# EasyEDA Pro project ProDocument_Schematic1_2023-08-22.epro

# Schematic Schematic1
Create Date: 2022-09-20; Page Name: P1; Project Name: 智能体重测量系统; Schematic Name: Schematic1; Update Date: 2022-09-21; Company: 嘉立创EDA
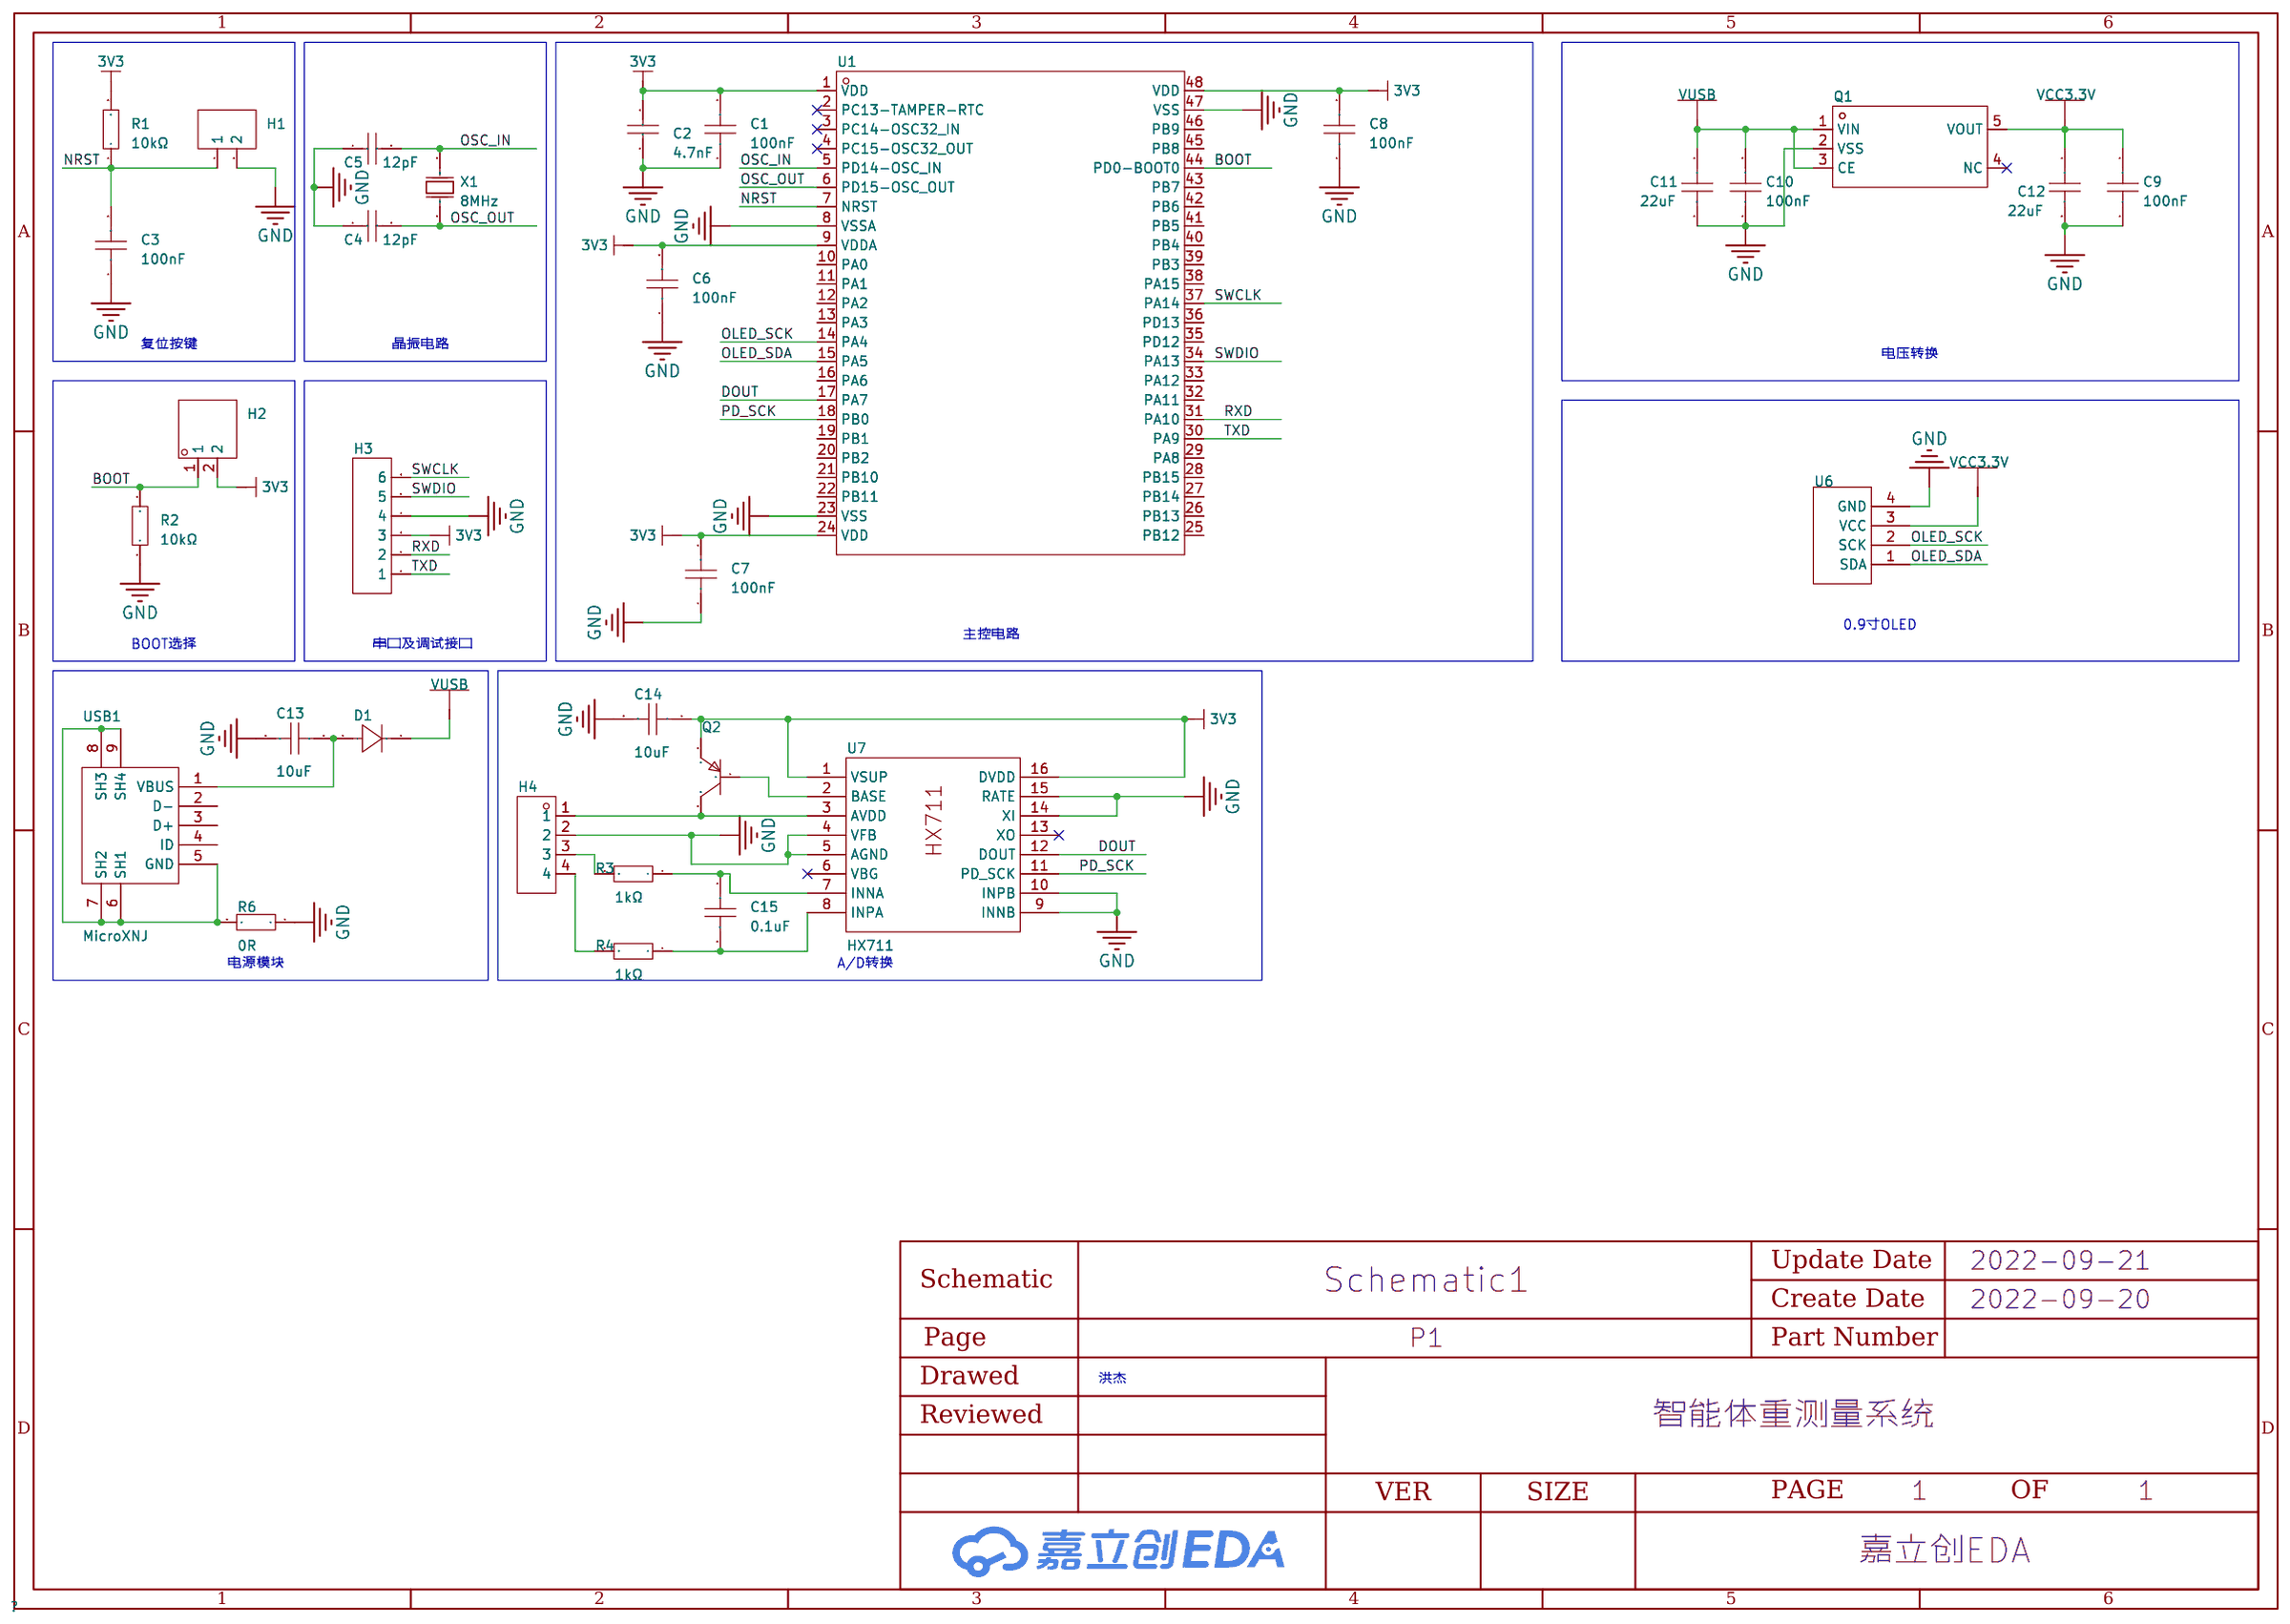
[diagram p0: schematic sheet]

## Parts
C1  100nF  [C0603]
C2  4.7nF  [C0603]
C3  100nF  [C0603]
C4  12pF  [C0603]
C5  12pF  [C0603]
C6  100nF  [C0603]
C7  100nF  [C0603]
C8  100nF  [C0603]
C9  100nF  [C0603]
C10  100nF  [C0603]
C11  22uF  [C0603]
C12  22uF  [C0603]
C13  10uF  [C0603]
C14  10uF  [C0603]
C15  0.1uF  [C0603]
D1  -  [DO-41_BD2.4-L4.7-P8.70-D0.9-RD]
H1  -  [HDR-TH_2P-P2.54-V-F]
H2  -  [HDR-TH_2P-P2.54-V-M-1]
H3  -  [HDR-TH_6P-P2.54-V-M-1]
H4  -  [HDR-TH_4P-P2.54-V-M]
Q1  -  [SOT-25-5_L3.0-W1.8-P0.95-LS3.0-BR]
Q2  -  [TO-236-3_L2.9-W1.3-P1.90-LS2.4-BR]
R1  10kΩ  [R0603]
R2  10kΩ  [R0603]
R3  1kΩ  [R0603]
R4  1kΩ  [R0603]
R6  0R  [R0603]
U1  N32G430C8L7  [LQFP-48_L7.0-W7.0-P0.50-LS9.0-BL]
U6  0.91OLED-IIC-IO4  [0.91-OLED-IIC-12832]
U7  HX711  [SOP-16_L10.0-W3.9-P1.27-LS6.0-BL]
USB1  MicroXNJ  [MICRO-USB-SMD_MICROXNJ]
X1  8MHz  [OSC-SMD_L5.0-W3.2]

## Library data of the parts
C1 C3 C6-C8 C13-C15 = CC0603KRX7R9BB104: 容值:100nF;精度:±10%;额定电压:50V;材质(温度系数):X7R;; LCSC Part Name: 100nF ±10% 50V; Supplier Part: C14663; Manufacturer: YAGEO(国巨); Supplier Footprint: 0603; JLCPCB Part Class: 基础库; Datasheet: https://atta.szlcsc.com/upload/public/pdf/source/20170116/1484561234239.pdf; Supplier: LCSC; Tolerance: ±10%; Voltage Rated: 50V; Temperature Coefficient: X7R
C2 = 1206B472K102NT: 容值:4.7nF;精度:±10%;额定电压:1kV;材质(温度系数):X7R;; LCSC Part Name: 4.7nF ±10% 1kV; Supplier Part: C9192; Manufacturer: FH(风华); Supplier Footprint: 1206; JLCPCB Part Class: 扩展库; Datasheet: https://atta.szlcsc.com/upload/public/pdf/source/20170923/C9192_1506149570157988982.pdf; Supplier: LCSC; Tolerance: ±10%; Voltage Rated: 1kV; Temperature Coefficient: X7R
C4 C5 = CL10C120JB8NNNC: 温度系数:C0G;容值:12pF;精度:±5%;额定电压:50V;; LCSC Part Name: 12pF(120) ±5% 50V; Supplier Part: C38523; Manufacturer: SAMSUNG(三星); Supplier Footprint: 0603; JLCPCB Part Class: 基础库; Datasheet: https://atta.szlcsc.com/upload/public/pdf/source/20160103/1457707725436.pdf; Supplier: LCSC; Temperature Coefficient: C0G; Tolerance: ±5%; Voltage Rated: 50V
C9 C10 = HMK107B7104KA-T: 容值:100nF;精度:±10%;额定电压:100V;温度系数:X7R;; LCSC Part Name: 100nF ±10% 100V; Supplier Part: C385971; Manufacturer: TAIYO YUDEN(太诱); Supplier Footprint: 0603; JLCPCB Part Class: Extended Part; Datasheet: https://atta.szlcsc.com/upload/public/pdf/source/20190425/C385971_F9611C3959A75AB059BC924634A5F45B.pdf; Supplier: LCSC; Tolerance: ±10%; Voltage Rated: 100V; Temperature Coefficient: X7R
C11 C12 = GRM186R60J226ME15D: 容值:22uF;精度:±20%;额定电压:6.3V;温度系数:X5R;; LCSC Part Name: 22uF ±20% 6.3V; Supplier Part: C237460; Manufacturer: muRata(村田); Supplier Footprint: 0603; JLCPCB Part Class: Extended Part; Datasheet: https://atta.szlcsc.com/upload/public/pdf/source/20181211/C237460_A5C1E874024C2D1A3551B41AB30C20A3.pdf; Supplier: LCSC; Tolerance: ±20%; Voltage Rated: 6.3V; Temperature Coefficient: X5R
D1 = 1N4007: 二极管配置:-;直流反向耐压(Vr):1kV;平均整流电流(Io):1A;正向压降(Vf):1.1V@1A;反向电流(Ir):5A@1kV;; Supplier Footprint: DO-41; Supplier Part: C106903; JLCPCB Part Class: Extended Part
H1 = HDR-F_2.54_1x2P: Supplier Part: C49661; Supplier Footprint: 插件
H2 = HDR-M_2.54_1x2P: Supplier Part: C124375; Supplier Footprint: 插件
H3 = HDR-M_2.54_1x6P: Supplier Part: C37208; Supplier Footprint: 插件
H4 = HDR-M_2.54_1x4P: Supplier Part: C492403; Supplier Footprint: 插件
Q1 = XC6220B331MR-G: 输出类型:固定;输出极性:正;输出通道数:1;最大输入电压:6V;输出电压:3.3V;压差:655mV@(1A);输出电流:1A;电源纹波抑制比(PRSS):50dB@(1kHz);; LCSC Part Name: Vin=6V Vout=3.3V 1A 50dB@(1kHz); Supplier Part: C86534; Manufacturer: TOREX(特瑞仕); Supplier Footprint: SOT-25; JLCPCB Part Class: Extended Part; Datasheet: https://atta.szlcsc.com/upload/public/pdf/source/20161119/1479540186106.pdf; Supplier: LCSC; Output Type: 固定; Output Polarity: 正; Number of Outputs: 1; Maximum Input Voltage: 6V; Output Voltage: 3.3V; Dropout Voltage: 655mV@(1A); Output Current: 1A; Power Supply Rejection Ratio (PRSS): 50dB@(1kHz)
Q2 = S8550_PNP: 晶体管类型:PNP;集射极击穿电压(Vceo):25V;集电极电流(Ic):500mA;功率(Pd):300mW;集电极-发射极饱和电压(VCE(sat)@Ic,Ib):600mV@500mA,50mA;直流电流增益(hFE@Ic,Vce):-;特征频率(fT):150MHz;工作温度:+150@(Tj);; Supplier Part: C444725; Supplier Footprint: SOT-23
R1-R4 = 0603WAF1002T5E: 电阻类型:厚膜电阻;阻值:10kΩ;精度:±1%;功率:100mW;温度系数:±100ppm/;最大工作电压:75V;工作温度范围:-55~+155;; LCSC Part Name: 10kΩ ±1% 100mW; Supplier Part: C25804; Manufacturer: UNI-ROYAL(厚声); Supplier Footprint: 0603; JLCPCB Part Class: 基础库; Datasheet: https://atta.szlcsc.com/upload/public/pdf/source/20200306/C422600_1E6D84923E4A46A82E41ADD87F860B5C.pdf; Supplier: LCSC; Type: 厚膜电阻; Tolerance: ±1%; Power(Watts): 100mW; Temperature Coefficient: ±100ppm/; Overload Voltage (Max): 75V; Operating Temperature Range: -55~+155
R6 = Res_0603: Supplier Footprint: 0603; Supplier Part: C713447
U1 = N32G430C8L7: Supplier Part: C3032170; Manufacturer: Nations(国民技术); Supplier Footprint: LQFP48; JLCPCB Part Class: 扩展库; Datasheet: https://atta.szlcsc.com/upload/public/pdf/source/20220608/411F2C1C49F3955F5F0689A973473AF7.pdf; Supplier: LCSC
U6 = 0.91oled-iic-io4: Pin Type: IN
U7 = HX711: A/D 位数:24;采样率（sps）:10,80;输入数:2;输入类型:Differential;; Supplier Part: C43656; Manufacturer: AVIA(海芯科技); Supplier Footprint: SOP-16_150mil; JLCPCB Part Class: 扩展库; Datasheet: https://atta.szlcsc.com/upload/public/pdf/source/20201105/C43656_14FD91CAE53E7DB415D03EABCB162D83.pdf; Supplier: LCSC; Number of Bits: 24; Sampling Rate (Per Second): 10,80; Number of Inputs: 2; Input Type: Differential; Voltage - Supply: 2.6V~5.5V
USB1 = MicroXNJ: 连接器类型:Micro-B;标准:USB 2.0;公母:母座;触点数量:5;端口数量:1;安装方式:卧贴;额定电流 - 电源:1A;工作温度范围:-20~+85;; LCSC Part Name: MICRO USB 母座 小牛角有柱 卷边 编带; Supplier Part: C404969; Manufacturer: SHOU HAN(首韩); Supplier Footprint: SMD; JLCPCB Part Class: 扩展库; Datasheet: https://atta.szlcsc.com/upload/public/pdf/source/20190722/C404969_F527F22D40F2F6F2B0B236E459D2C165.pdf; Supplier: LCSC; Connector Type: Micro-B; Standard: USB 2.0; Gender: 母座; Number of Contacts: 5; Number of Ports: 1; Mounting Style: 卧贴; Current Rating - Power (Max): 1A; Operating Temperature Range: -20~+85
X1 = TAXM8M2QLFCDT1T: 晶振类型:SMD 谐振器;频率:8MHz;频率公差:±30ppm;频率稳定度:±20ppm;负载电容:20pF;等效串联电阻(ESR):80Ω;工作温度:-40~85;; LCSC Part Name: 8MHz ±30ppm 20pF; Supplier Part: C122522; Manufacturer: TAE(雅晶鑫); Supplier Footprint: SMD5032-2P; JLCPCB Part Class: 扩展库; Datasheet: https://atta.szlcsc.com/upload/public/pdf/source/20220113/59EE8A0E7B9F67FF1BF3C454890DE4E5.pdf; Supplier: LCSC; Crystal Type: SMD 谐振器; Frequency Tolerance: ±30ppm; Frequency Stability: ±20ppm; Load Capacitance: 20pF; Equivalent Series Resistance (ESR): 80Ω; Operating Temperature: -40~85

## Nets
3V3: C1.2 C2.2 C6.2 C7.2 C8.2 C14.1 H2.2 H3.3 Q2.2(E) R1.2 U1.1(VDD) U1.9(VDDA) U1.24(VDD) U1.48(VDD) U7.1(VSUP) U7.16(DVDD)
GND: C1.1 C2.1 C3.1 C4.1 C5.1 C6.1 C7.1 C8.1 C9.1 C10.1 C11.2 C12.2 C13.2 C14.2 H1.2 H3.4 H4.2 Q1.2(VSS) R2.1 R6.1 U1.8(VSSA) U1.23(VSS) U1.47(VSS) U6.4(GND) U7.4(VFB) U7.5(AGND) U7.9(INNB) U7.10(INPB) U7.14(XI) U7.15(RATE)
VCC3.3V: C9.2 C12.1 Q1.5(VOUT) U6.3(VCC)
BOOT: H2.1 R2.2 U1.44(PD0-BOOT0)
DOUT: U1.17(PA7) U7.12(DOUT)
NRST: C3.2 H1.1 R1.1 U1.7(NRST)
OLED_SCK: U1.14(PA4) U6.2(SCK)
OLED_SDA: U1.15(PA5) U6.1(SDA)
OSC_IN: C5.2 U1.5(PD14-OSC_IN) X1.2(OSC2)
OSC_OUT: C4.2 U1.6(PD15-OSC_OUT) X1.1(OSC1)
PD_SCK: U1.18(PB0) U7.11(PD_SCK)
RXD: H3.2 U1.31(PA10)
SWCLK: H3.6 U1.37(PA14)
SWDIO: H3.5 U1.34(PA13)
TXD: H3.1 U1.30(PA9)
VUSB: C10.2 C11.1 D1.1(K) Q1.1(VIN) Q1.3(CE)
Net-(C13-1): C13.1 D1.2(A) USB1.1(VBUS)
Net-(C15-1): C15.1 R3.1 U7.7(INNA)
Net-(C15-2): C15.2 R4.1 U7.8(INPA)
Net-(H4-1): H4.1 Q2.3(C) U7.3(AVDD)
Net-(H4-3): H4.3 R3.2
Net-(H4-4): H4.4 R4.2
Net-(Q2-1): Q2.1(B) U7.2(BASE)
Net-(R6-2): R6.2 USB1.5(GND) USB1.6(SH1) USB1.7(SH2) USB1.8(SH3) USB1.9(SH4)

Not connected (* = marked no-connect by the designer): Q1 4(NC)*; U1 2(PC13-TAMPER-RTC)* 3(PC14-OSC32_IN)* 4(PC15-OSC32_OUT)* 10(PA0) 11(PA1) 12(PA2) 13(PA3) 16(PA6) 19(PB1) 20(PB2) 21(PB10) 22(PB11) 25(PB12) 26(PB13) 27(PB14) 28(PB15) 29(PA8) 32(PA11) 33(PA12) 35(PD12) 36(PD13) 38(PA15) 39(PB3) 40(PB4) 41(PB5) 42(PB6) 43(PB7) 45(PB8) 46(PB9); U7 6(VBG)* 13(XO)*; USB1 2(D-) 3(D+) 4(ID)

## Notes on the sheet
- 复位按键
- 晶振电路
- 电压转换
- 0.9寸OLED
- BOOT选择
- 串口及调试接口
- 主控电路
- 电源模块
- A/D转换
- 洪杰
